# EAGLE design TRS NANO (EAGLE 6.6.0)
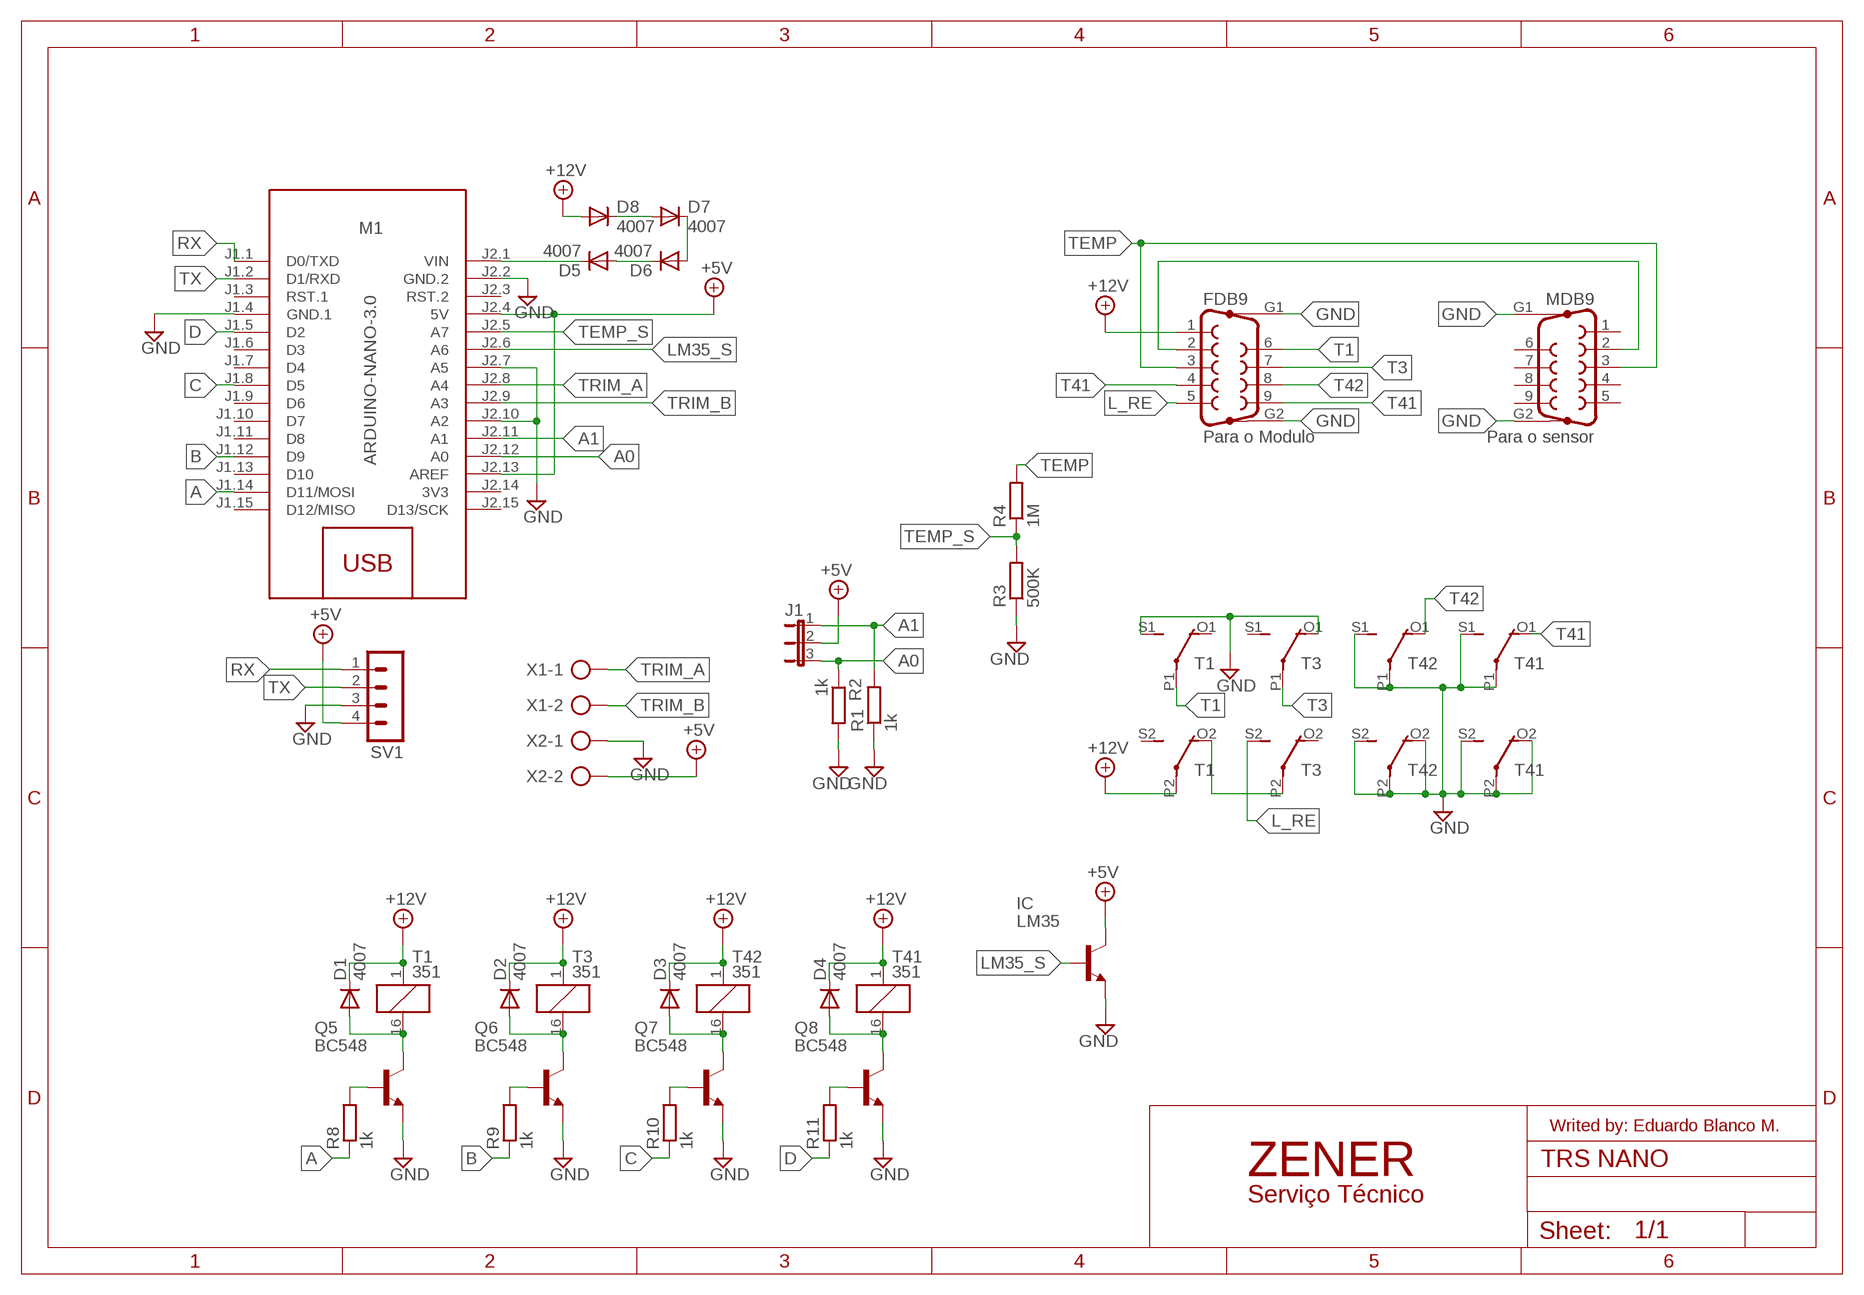
[diagram p0: schematic, sheet 1]

## Parts
D1  4007  DIODE-D-7.5  [D-7.5]
D2  4007  DIODE-D-7.5  [D-7.5]
D3  4007  DIODE-D-7.5  [D-7.5]
D4  4007  DIODE-D-7.5  [D-7.5]
D5  4007  DIODE-D-7.5  [D-7.5]
D6  4007  DIODE-D-7.5  [D-7.5]
D7  4007  DIODE-D-7.5  [D-7.5]
D8  4007  DIODE-D-7.5  [D-7.5]
FDB9  Para o Modulo  F09HP  [F09HP]
IC  LM35  BC548  [TO92-EBC]
J1  JP2W  [JP2W]
M1  ARDUINO-NANO-3.0  [ARDUINO-NANO-3.0]
MDB9  Para o sensor  F09HP  [F09HP]
Q5  BC548  [TO92-EBC]
Q6  BC548  [TO92-EBC]
Q7  BC548  [TO92-EBC]
Q8  BC548  [TO92-EBC]
R1  1k  R-EU_0207/10  [0207/10]
R2  1k  R-EU_0207/7  [0207/7]
R3  500K  R-EU_0207/7  [0207/7]
R4  1M  R-EU_0207/15  [0207/15]
R8  1k  R-EU_0207/5V  [0207/5V]
R9  1k  R-EU_0207/5V  [0207/5V]
R10  1k  R-EU_0207/5V  [0207/5V]
R11  1k  R-EU_0207/5V  [0207/5V]
SV1  MA04-1  [MA04-1]
T1  351  [351]
T3  351  [351]
T41  351  [351]
T42  351  [351]
X1  AK500/2  [AK500/2]
X2  AK500/2  [AK500/2]

## Nets
+5V: IC.C J1.2 M1.J2.4(5V) M1.J2.13(AREF) SV1.4 X2.2
+12V: D1.C D2.C D3.C D4.C D8.A FDB9.1 T1.1 T1.P2(3:P) T3.1 T41.1 T42.1
A: M1.J1.14(D11/MOSI) R8.1
A0: J1.3 M1.J2.12(A0) R2.1
A1: J1.1 M1.J2.11(A1) R1.2
B: M1.J1.12(D9) R9.1
C: M1.J1.8(D5) R10.1
D: M1.J1.5(D2) R11.1
GND: FDB9.G1 FDB9.G2 IC.E M1.J1.4(GND.1) M1.J2.2(GND.2) M1.J2.7(A5) M1.J2.10(A2) MDB9.G1 MDB9.G2 Q5.E Q6.E Q7.E Q8.E R1.1 R2.2 R3.1 SV1.3 T1.S1(2:S) T3.O1(2:O) T41.O2(3:O) T41.P1(2:P) T41.P2(3:P) T41.S1(2:S) T41.S2(3:S) T42.O2(3:O) T42.P1(2:P) T42.P2(3:P) T42.S1(2:S) T42.S2(3:S) X2.1
L_RE: FDB9.5 T3.S2(3:S)
LM35_S: IC.B M1.J2.6(A6)
N$1: T1.O2(3:O) T3.P2(3:P)
N$4: Q6.B R9.2
N$5: Q7.B R10.2
N$6: Q8.B R11.2
N$7: D5.C M1.J2.1(VIN)
N$8: Q5.B R8.2
N$9: FDB9.2 MDB9.2
N$10: D5.A D6.C
N$11: D6.A D7.C
N$12: D1.A Q5.C T1.16
N$13: D2.A Q6.C T3.16
N$14: D3.A Q7.C T42.16
N$15: D4.A Q8.C T41.16
N$16: D7.A D8.C
RX: M1.J1.1(D0/TXD) SV1.1
T1: FDB9.6 T1.P1(2:P)
T3: FDB9.7 T3.P1(2:P)
T41: FDB9.4 FDB9.9 T41.O1(2:O)
T42: FDB9.8 T42.O1(2:O)
TEMP: FDB9.3 MDB9.3 R4.2
TEMP_S: M1.J2.5(A7) R3.2 R4.1
TRIM_A: M1.J2.8(A4) X1.1
TRIM_B: M1.J2.9(A3) X1.2
TX: M1.J1.2(D1/RXD) SV1.2
Unconnected: M1.J1.3(RST.1) M1.J1.6(D3) M1.J1.7(D4) M1.J1.9(D6) M1.J1.10(D7) M1.J1.11(D8) M1.J1.13(D10) M1.J1.15(D12/MISO) M1.J2.3(RST.2) M1.J2.15(D13/SCK) MDB9.1 MDB9.4 MDB9.5 MDB9.6 MDB9.7 MDB9.8 MDB9.9 T1.O1(2:O) T1.S2(3:S) T3.O2(3:O) T3.S1(2:S)

## Notes on the sheet
- Writed by: Eduardo Blanco M.
- ZENER
- Serviço Técnico

## Power pins joined to a net without a drawn wire
3V3: M1.J2.14(3V3)

## Library data of the parts
D1-D8 = diode:DIODE-: DIODE
FDB9 MDB9 = con-subd:F09HP: SUB-D; OC_FARNELL: unknown; OC_NEWARK: unknown
IC Q5-Q8 = transistor-npn:BC548*: NPN Transistor
J1 = jumper:JP2W: JUMPER
M1 = diy-modules:ARDUINO-NANO-3.0: Arduino Nano 3.0
R1-R4 R8-R11 = rcl:R-EU_: RESISTOR, European symbol
SV1 = con-lstb:MA04-1: PIN HEADER; OC_FARNELL: unknown; OC_NEWARK: unknown
T1 T3 T41 T42 = relay:351: RELAY 2 x switch, Omron; OC_FARNELL: unknown; OC_NEWARK: unknown
X1 X2 = con-ptr500:AK500/2: CONNECTOR; OC_FARNELL: unknown; OC_NEWARK: unknown

## Board
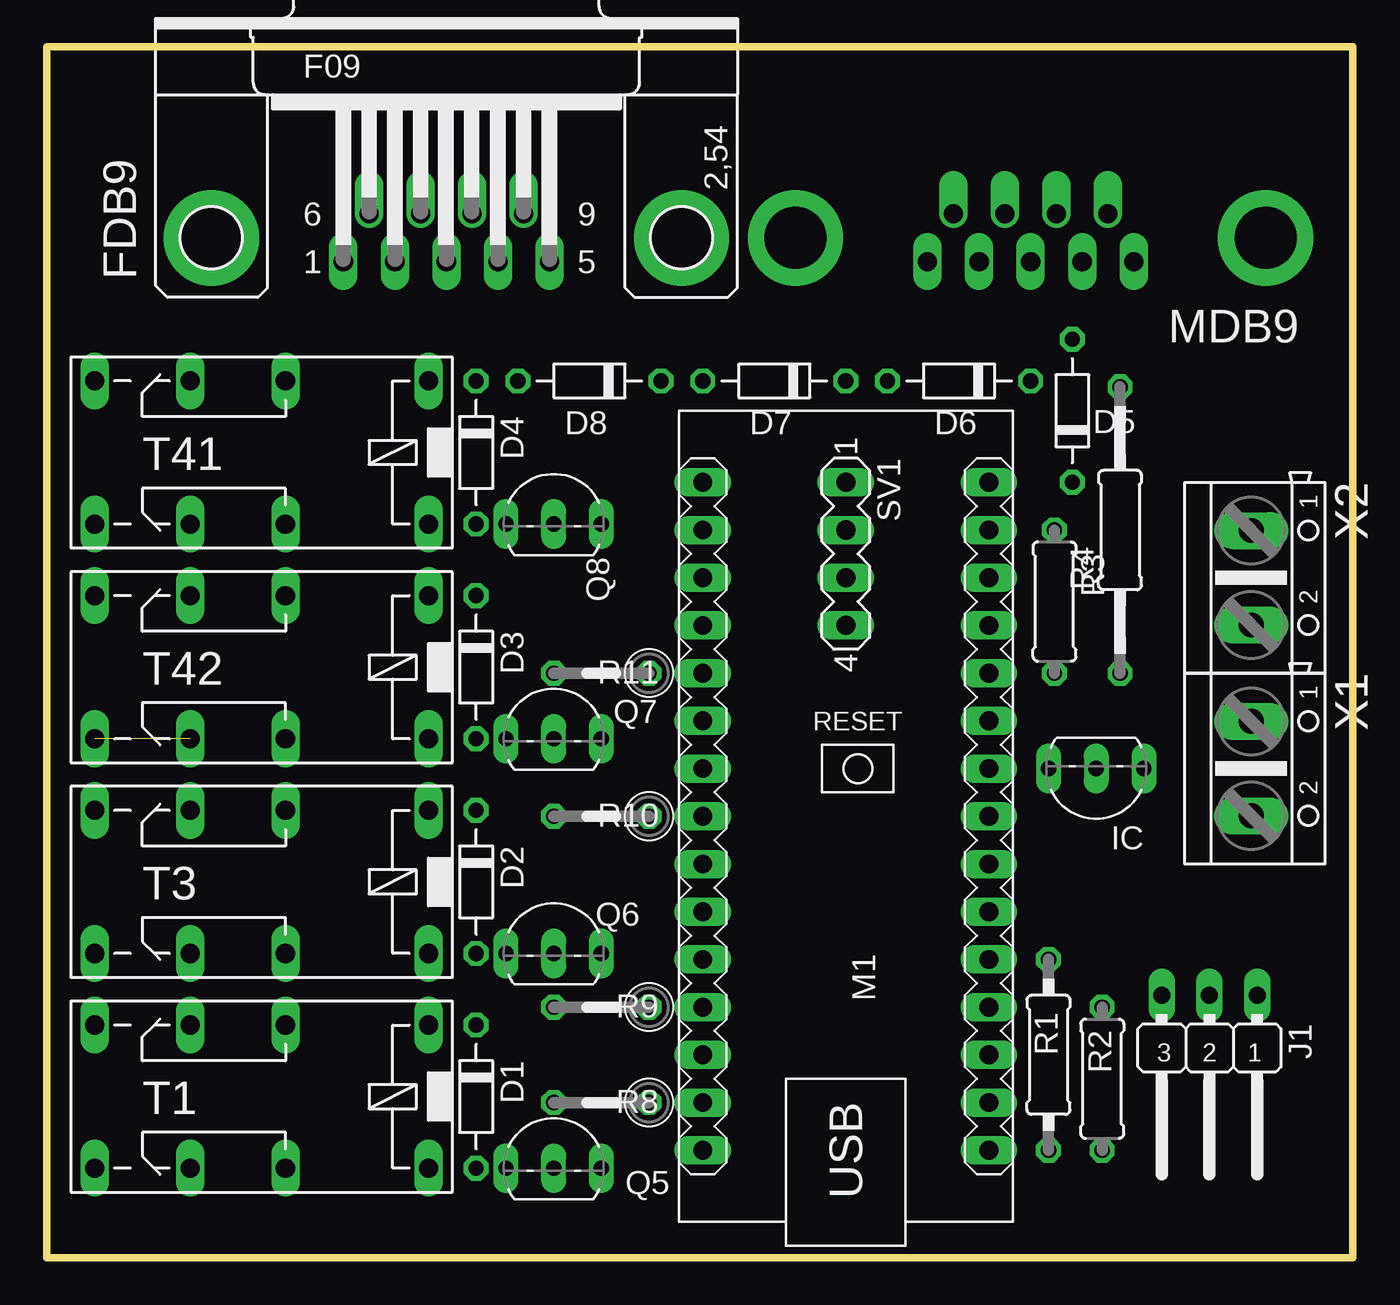
[diagram p1: board, top side]
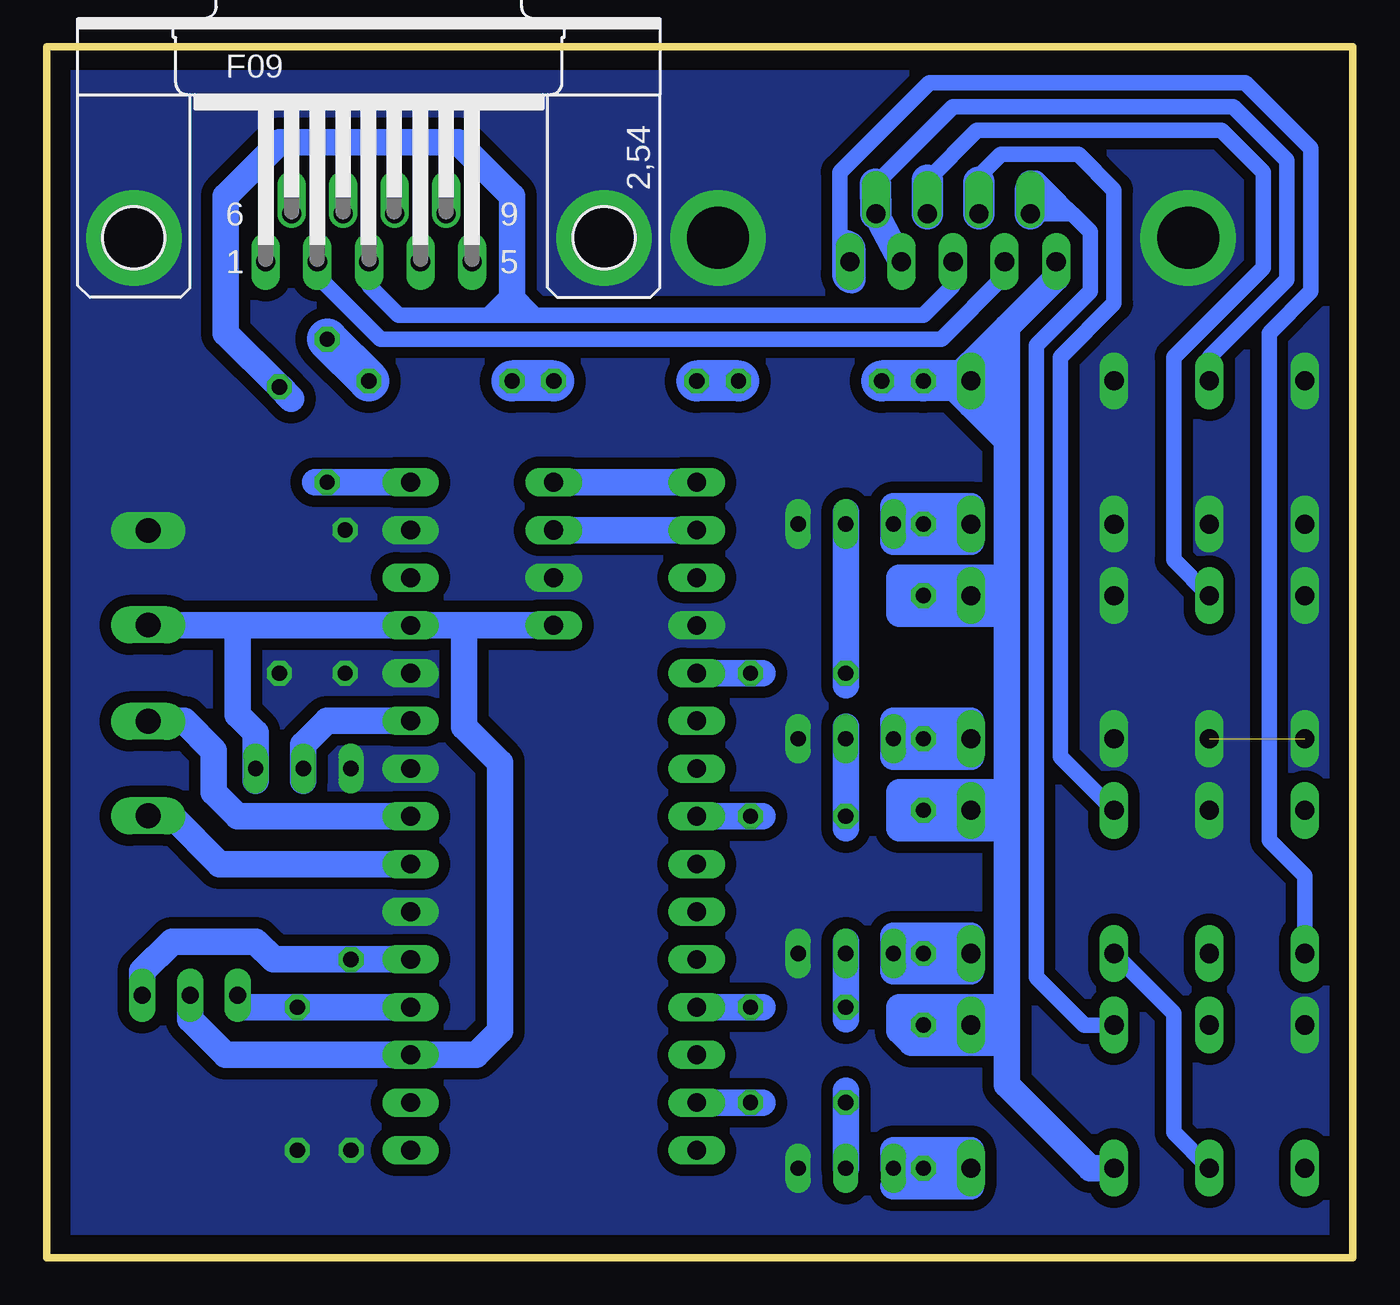
[diagram p2: board, bottom side, seen from below]

Size 69.53 x 64.45 mm. Coordinates in mm from the lower left corner, seen from the top.
Outline: 0,0 0,64.45 69.53,64.45 69.53,0 0,0
Copper layers (1*16): Top 0.035mm / dielectric 1.5mm / Bottom 0.035mm
Design rules "default": minimum track width 10mil, minimum drill 24mil, track to track 8mil, track to pad 8mil, pad to pad 8mil, via to via 8mil, smd to smd 8mil, copper to edge 40mil, drill to drill 8mil, minimum pad ring 10mil, minimum via ring 8mil, stop-mask expansion 4mil, vias tented up to drill 0mil, thermal gap 10mil

### Footprints (pad centres in the part's own frame; a part is rotated, then mirrored left to right if it is on the bottom)
D-7.5 = drill 0.813 octagon: A 3.81,0; C -3.81,0
F09HP = drill 1.016 long: 1 -5.486,-1.27; 2 -2.743,-1.27; 3 0,-1.27; 4 2.743,-1.27; 5 5.486,-1.27 | drill 1.016 offset: 6 -4.115,1.27; 7 -1.372,1.27; 8 1.372,1.27; 9 4.115,1.27 | drill 3.302 pad 5.08: G1 -12.522,0; G2 12.522,0
TO92-EBC = drill 0.813 long: B 0,-1.27; C -2.54,-1.27; E 2.54,-1.27
JP2W = drill 0.914 long: 1 -2.54,-1.27; 2 0,-1.27; 3 2.54,-1.27
ARDUINO-NANO-3.0 = drill 1 long: J1.1 17.78,7.62; J1.2 15.24,7.62; J1.3 12.7,7.62; J1.4 10.16,7.62; J1.5 7.62,7.62; J1.6 5.08,7.62; J1.7 2.54,7.62; J1.8 0,7.62; J1.9 -2.54,7.62; J1.10 -5.08,7.62; J1.11 -7.62,7.62; J1.12 -10.16,7.62; J1.13 -12.7,7.62; J1.14 -15.24,7.62; J1.15 -17.78,7.62; J2.1 17.78,-7.62; J2.2 15.24,-7.62; J2.3 12.7,-7.62; J2.4 10.16,-7.62; J2.5 7.62,-7.62; J2.6 5.08,-7.62; J2.7 2.54,-7.62; J2.8 0,-7.62; J2.9 -2.54,-7.62; J2.10 -5.08,-7.62; J2.11 -7.62,-7.62; J2.12 -10.16,-7.62; J2.13 -12.7,-7.62; J2.14 -15.24,-7.62; J2.15 -17.78,-7.62
0207/10 = drill 0.813 octagon: 1 -5.08,0; 2 5.08,0
0207/7 = drill 0.813 octagon: 1 -3.81,0; 2 3.81,0
0207/15 = drill 0.813 octagon: 1 -7.62,0; 2 7.62,0
0207/5V = drill 0.813 octagon: 1 -2.54,0; 2 2.54,0
MA04-1 = drill 1.016 long: 1 -3.81,0; 2 -1.27,0; 3 1.27,0; 4 3.81,0
351 = drill 1.016 long: 1 -3.81,-3.81; 16 -3.81,3.81; O1 8.89,-3.81; O2 8.89,3.81; P1 3.81,-3.81; P2 3.81,3.81; S1 13.97,-3.81; S2 13.97,3.81
AK500/2 = drill 1.321 long: 1 -2.515,0; 2 2.515,0

### Placement (x,y rotation side)
D1  22.86,8.57 270 top
D2  22.86,20 270 top
D3  22.86,31.43 270 top
D4  22.86,42.86 270 top
D5  54.61,45.09 90 top
D6  48.58,46.67 180 top
D7  38.74,46.67 180 top
D8  28.89,46.67 180 top
FDB9  21.27,54.29 0 top
IC  55.88,24.77 180 top
J1  61.91,12.7 180 top
M1  42.55,23.5 90 top
MDB9  52.39,54.29 0 bottom
Q5  26.99,6.03 0 top
Q6  26.99,17.46 0 top
Q7  26.99,28.89 0 top
Q8  26.99,40.32 0 top
R1  53.34,10.79 90 top
R2  56.2,9.53 270 top
R3  53.66,34.93 270 top
R4  57.15,38.74 90 top
R8  29.53,8.26 180 top
R9  29.53,13.33 180 top
R10  29.53,23.5 180 top
R11  29.53,31.11 180 top
SV1  42.55,37.47 270 top
T1  16.51,8.57 180 top
T3  16.51,20 180 top
T41  16.51,42.86 180 top
T42  16.51,31.43 180 top
X1  64.14,26.04 270 top
X2  64.14,36.2 270 top

### Tracks (layer width: path | path; a pad name or v marks a point on that pad's centre or on a via)
+5V
  Bottom 1.422: J1.2 61.91,12.7 60.01,10.79 M1.J2.13 46.67,10.79 45.4,12.06 45.4,26.35 47.31,28.26 47.31,33.66 | 59.37,33.66 M1.J2.4 47.31,33.66 | 59.37,33.66 59.37,28.89 58.42,27.94 IC.C 58.42,25.4 | 59.37,33.66 64.11,33.66 X2.2 | SV1.4 47.31,33.66
+12V
  Bottom 1.422: 24.13,12.06 23.5,11.43 18.41,11.43 | 18.41,13.33 24.13,13.33 24.13,12.06 | 24.13,12.06 D1.C T1.1 18.41,12.38 | T3.1 D2.C | T42.1 D3.C | 18.41,44.77 18.41,48.9 | 18.41,49.53 18.41,48.9 | 18.41,48.9 19.37,47.94 19.37,45.72 18.41,44.77 | 18.41,44.77 18.41,43.5 | 18.41,43.5 18.41,36.2 | 18.41,34.29 18.41,24.77 | 18.41,22.86 18.41,13.33 | 18.41,13.33 18.41,12.38 | 18.41,12.38 18.41,11.43 | 18.41,11.43 18.41,9.21 13.97,4.76 T1.P2 | T3.1 23.81,23.81 | T3.1 18.41,23.81 | 18.41,23.81 18.41,24.77 | 18.41,24.77 24.13,24.77 24.13,22.86 18.41,22.86 | 18.41,22.86 18.41,23.81 | T42.1 23.18,35.24 | T42.1 18.41,35.24 | 18.41,35.24 18.41,34.29 | 18.41,34.29 24.13,34.29 24.13,36.2 18.41,36.2 | 18.41,36.2 18.41,35.24 | 20.32,47.62 T41.1 20.32,45.4 | 20.32,47.62 21.27,46.67 | 20.32,47.62 15.79,52.16 FDB9.1 | 20.32,45.4 21.59,46.67 | 20.32,45.4 18.41,43.5
  Bottom 2.184: T41.1 D4.C D8.A
A
  Bottom 1.422: M1.J1.14 R8.1 31.43,8.26
A0
  Bottom 1.422: M1.J2.12 R2.1 59.37,13.33 J1.3
A1
  Bottom 1.422: M1.J2.11 R1.2 57.47,15.88 58.42,16.83 62.87,16.83 64.45,15.24 J1.1
B
  Bottom 1.422: M1.J1.12 R9.1 31.43,13.33
C
  Bottom 1.422: M1.J1.8 R10.1 31.43,23.5
D
  Bottom 1.422: M1.J1.5 R11.1 31.43,31.11
GND  (1 unrouted)
  pour Bottom (isolate 0.61, no thermals): 1.27,1.27 1.27,63.18 68.26,63.18 68.26,1.27
L_RE
  Bottom 0.813: T3.S2 2.54,20.32 4.45,22.22 4.45,49.21 2.22,51.44 2.22,59.05 5.71,62.55 22.54,62.55 27.3,57.79 27.3,52.39 arc-90 26.67,51.75 arc-90 26.35,52.07 26.35,53.66 arc-90 26.99,54.29 26.99,52.71 arc-90 26.67,52.39 26.67,52.93 arc-90 FDB9.5
LM35_S
  Bottom 1.422: M1.J2.6 54.61,28.57 55.88,27.3 IC.B 55.88,25.4
N$1
  Bottom 0.813: T3.P2 9.53,13.02 9.53,6.67 T1.O2
N$4
  Bottom 1.422: 26.99,16.83 Q6.B R9.2 26.99,12.7
N$5
  Bottom 1.422: 26.99,28.26 Q7.B R10.2 26.99,22.86
N$6
  Bottom 1.422: 26.99,39.69 Q8.B R11.2 26.99,30.48
N$7
  Bottom 1.422: M1.J2.1 D5.C 55.25,41.28
N$8
  Bottom 1.422: Q5.B R8.2 26.99,8.89
N$9
  Bottom 0.813: FDB9.2 18.53,52.27 21.91,48.9 51.75,48.9 55.13,52.27 MDB9.2
N$10
  Bottom 2.184: D6.C D5.A
N$11
  Bottom 2.184: D7.C D6.A
N$12
  Bottom 1.422: Q5.C 24.45,5.71 20.32,5.71 T1.16 | T1.16 20.32,3.81 23.5,3.81 | 24.45,3.81 23.5,3.81 | 23.5,3.81 24.13,4.76 D1.A T1.16
N$13
  Bottom 1.422: Q6.C 24.45,17.14 20.32,17.14 T3.16 | T3.16 20.32,15.24 24.45,15.24 Q6.C | Q6.C D2.A T3.16
N$14
  Bottom 1.422: T42.16 20.32,28.57 24.45,28.57 Q7.C | Q7.C 24.45,26.67 20.32,26.67 T42.16 | T42.16 D3.A Q7.C
N$15
  Bottom 1.422: T41.16 20.32,40.01 24.45,40.01 Q8.C | Q8.C 24.45,38.1 20.32,38.1 T41.16 | T41.16 D4.A Q8.C
N$16
  Bottom 2.184: D8.C D7.A
RX
  Bottom 1.422: M1.J1.1 SV1.1
T1
  Bottom 0.813: T1.P1 14.29,12.38 16.83,14.92 16.83,48.58 13.97,51.44 13.97,54.61 14.92,55.56 | 17.16,56.83 16.51,57.15 | 16.51,57.15 15.56,56.2 | 17.14,56.2 15.56,56.2 | 15.56,56.2 14.92,55.56 | 17.14,55.56 14.92,55.56 | 16.51,57.15 16.83,57.47 | 16.83,57.47 17.14,57.47 arc-90 17.46,57.15 17.14,57.15 arc-90 16.83,57.47
  Bottom 1.676: FDB9.6 17.16,56.83
T3
  Bottom 0.813: T3.P1 15.56,26.67 15.56,47.94 12.7,50.8 12.7,56.83 14.61,58.74 18.73,58.74 19.9,57.57 19.9,56.2
  Bottom 1.676: FDB9.7 19.9,56.2 19.9,57.25
T41
  Bottom 0.813: FDB9.9 25.39,55.58 | 25.4,57.15 21.27,61.28 6.35,61.28 3.49,58.42 3.49,52.07 7.62,47.94 T41.O1
  Bottom 1.422: FDB9.9 FDB9.4
  Bottom 1.676: 25.39,55.58 25.4,57.15
T42
  Bottom 0.813: T42.O1 9.53,37.15 9.53,47.94 4.76,52.71 4.76,57.79 6.98,60.01 20,60.01 22.64,57.37
  Bottom 1.676: FDB9.8 22.64,57.37
TEMP
  Bottom 0.813: 43.5,50.17 22.86,50.17 21.27,51.75 FDB9.3 | 46.36,50.17 43.5,50.17 | 43.5,50.17 44.77,51.44 46.04,50.17 | 46.04,50.17 50.8,50.17 52.39,51.75 MDB9.3 | 46.04,50.17 45.4,50.17 44.77,50.8
  Bottom 1.422: 44.77,50.8 44.77,56.52 47.62,59.37 57.15,59.37 60.01,56.52 60.01,49.21 R4.2 56.52,45.72
TEMP_S
  pour Bottom (isolate 0.61, no thermals): 47.94,33.66 47.94,27.94 59.05,27.94 59.05,33.66
TRIM_A
  Bottom 1.422: M1.J2.8 59.37,23.5 60.64,24.77 60.64,26.99 62.23,28.57 64.11,28.57 X1.1
TRIM_B
  Bottom 1.422: M1.J2.9 60.33,20.95 62.87,23.5 64.11,23.5 X1.2
TX
  Bottom 1.422: M1.J1.2 SV1.2